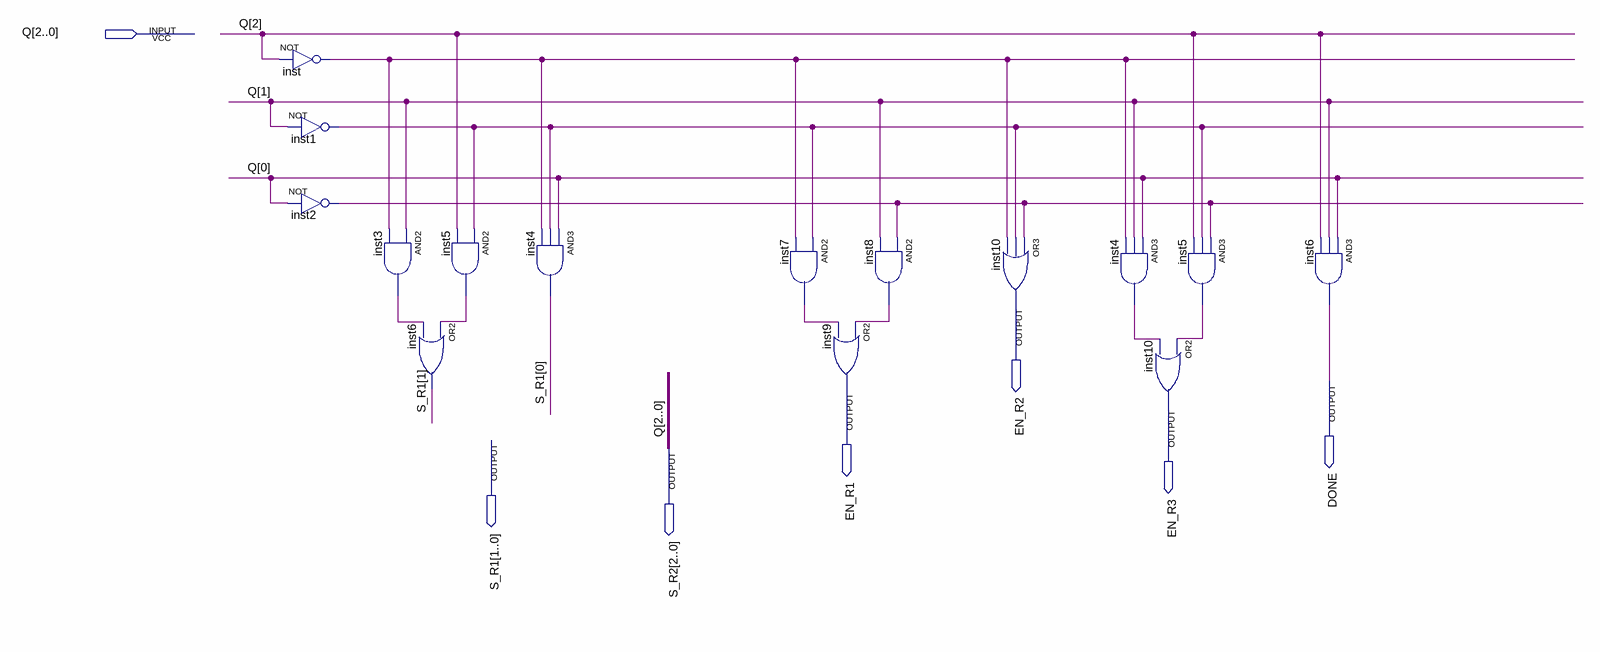
[diagram p0: schematic sheet]
// Quartus schematic CONTROL_SR.bdf as structural Verilog: 15 symbols, 7 pins
module CONTROL_SR (
  input  [2:0] Q,
  output EN_R2,
  output DONE,
  output EN_R1,
  output EN_R3,
  output [1:0] S_R1,
  output [2:0] S_R2
);

  wire inst1_out, inst2_out, inst3_out, inst4_out, inst5_out, inst5_out_2, inst7_out, inst8_out, inst_out;

  not inst (inst_out, Q[2]);
  not inst1 (inst1_out, Q[1]);
  not inst2 (inst2_out, Q[0]);
  and inst3 (inst3_out, Q[1], inst_out);
  and inst5 (inst5_out, inst1_out, Q[2]);
  or inst6 (S_R1[1], inst5_out, inst3_out);
  and inst4 (S_R1[0], Q[0], inst1_out, inst_out);
  and inst7 (inst7_out, inst1_out, inst_out);
  and inst8 (inst8_out, inst2_out, Q[1]);
  or inst9 (EN_R1, inst8_out, inst7_out);
  or inst10 (EN_R2, inst2_out, inst1_out, inst_out);
  and inst4_dup2 (inst4_out, Q[0], Q[1], inst_out);
  or inst10_dup2 (EN_R3, inst5_out_2, inst4_out);
  and inst5_dup2 (inst5_out_2, inst2_out, inst1_out, Q[2]);
  and inst6_dup2 (DONE, Q[0], Q[1], Q[2]);

  assign S_R2 = Q;
endmodule
